# Altium schematic sheet PCB.SchDoc
size A4
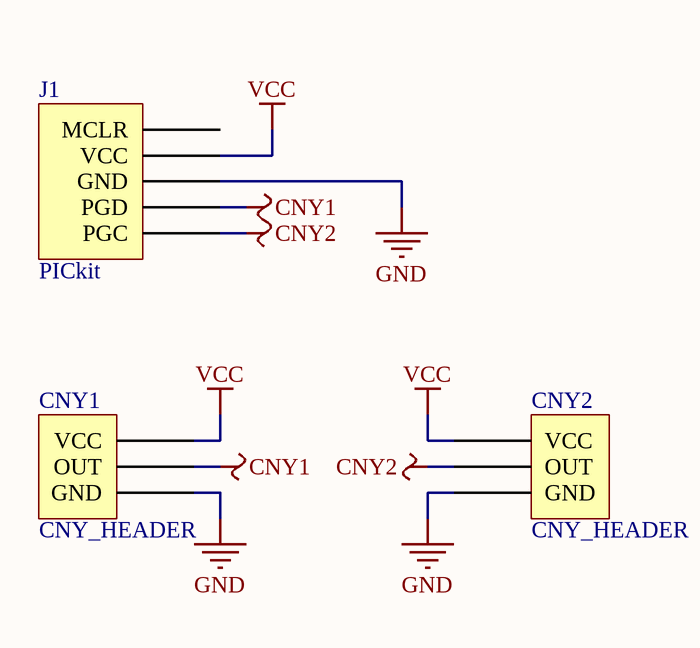
[diagram p0: PCB.SchDoc]

## Parts
CNY1  CNY_HEADER  [CNY_HEADER]
CNY2  CNY_HEADER  [CNY_HEADER]
J1  PICkit  [Header 1x5]

## Nets
CNY1: CNY1.3(OUT) J1.4(PGD)
CNY2: CNY2.3(OUT) J1.5(PGC)
GND: CNY1.1(GND) CNY2.1(GND) J1.3(GND)
VCC: CNY1.2(VCC) CNY2.2(VCC) J1.2(VCC)

Not connected (* = marked no-connect by the designer): J1 1(MCLR)